# Altium schematic sheet FPGA_Banks_64_65_HR.SchDoc: =ProjectName
size 420 x 297 mm; Author: T.P.; CompanyName: WUT; DrawnBy: T.P.; Organization: WUT ISE; Address1: Warsaw Univeristy of Technology; Address2: Nowowiejska 25/29; DocumentNumber: 7; Revision: 0.9; SheetNumber: 7; SheetTotal: 36; EDA_Number: ARTIQ; Projet: ARTIQ/SINARA; ModifiedBy: -; CreateDate: XX/XX/XXXX; CheckedDate: -; Title2: FPGA_Banks_64_65_HR.SchDoc; DivGrp: ISE; Designer: G.K. and T.P.; ModifiedDate: -; ProjectName: ADC/DAC MEZZANINE
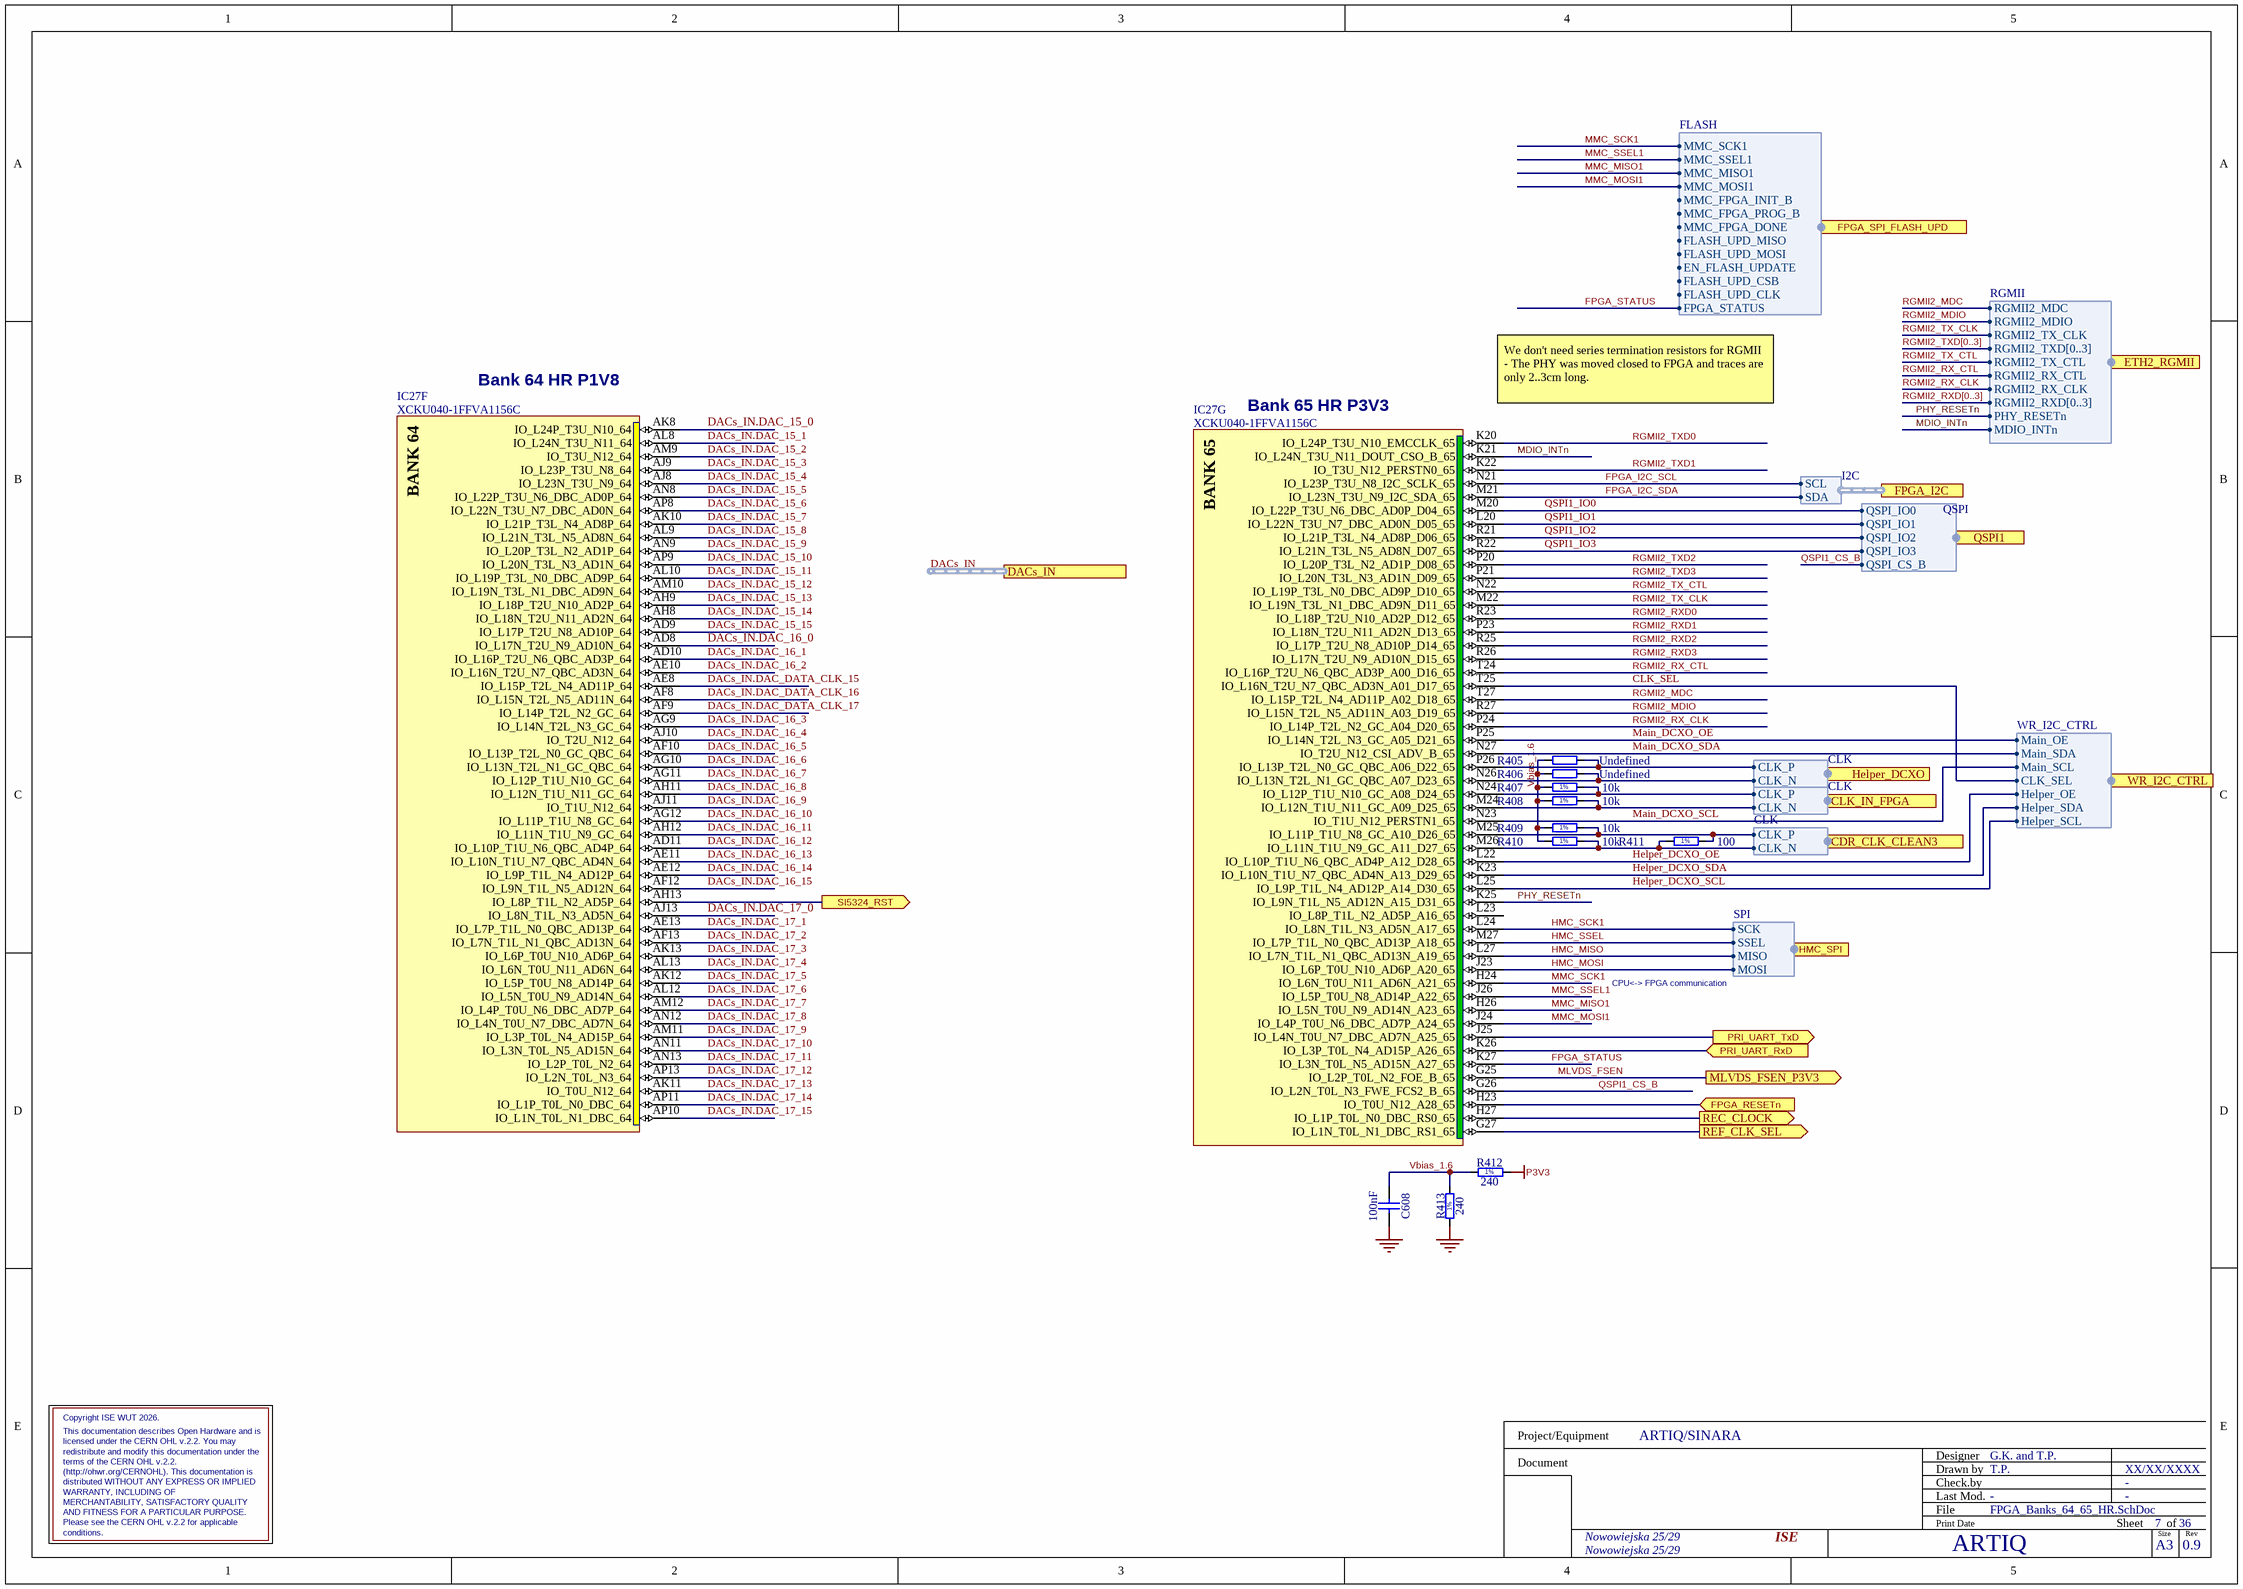
[diagram p0: FPGA_Banks_64_65_HR.SchDoc]

## Parts
C608  100nF  [CAPC0603X33N]
IC27  XCKU040-1FFVA1156C  [BGA1156C100P34X34_3500X3500X350]  (parts F,G of 22)
R405  Undefined  [RESC1005X40N]
R406  Undefined  [RESC1005X40N]
R407  10k  [RESC1005X40N]
R408  10k  [RESC1005X40N]
R409  10k  [RESC1005X40N]
R410  10k  [RESC1005X40N]
R411  100  [RESC1005X40N]
R412  240  [RESC1005X40N]
R413  240  [RESC1005X40N]

## Ports
CDR_CLK_CLEAN3 (harness CLK), CLK_IN_FPGA (harness CLK), DACs_IN (harness DAC_IN), ETH2_RGMII (harness RGMII), FPGA_I2C (harness I2C), FPGA_RESETn (in), FPGA_SPI_FLASH_UPD (harness FLASH), Helper_DCXO (harness CLK), HMC_SPI (harness SPI), MLVDS_FSEN_P3V3 (out), PRI_UART_RxD (in), PRI_UART_TxD (out), QSPI1 (harness QSPI), REC_CLOCK (out), REF_CLK_SEL (out), SI5324_RST (out), WR_I2C_CTRL (harness WR_I2C_CTRL)

## Harnesses
I2C: SCL, SDA
FLASH: MMC_SCK1, MMC_SSEL1, MMC_MISO1, MMC_MOSI1, MMC_FPGA_INIT_B, MMC_FPGA_PROG_B, MMC_FPGA_DONE, FLASH_UPD_MISO, FLASH_UPD_MOSI, EN_FLASH_UPDATE, FLASH_UPD_CSB, FLASH_UPD_CLK, FPGA_STATUS
CLK: CLK_N, CLK_P
QSPI: QSPI_IO1, QSPI_IO2, QSPI_IO3, QSPI_IO0, QSPI_CS_B
WR_I2C_CTRL: Main_OE, Main_SDA, Main_SCL, Helper_OE, Helper_SDA, Helper_SCL, CLK_SEL
SPI: SCK, SSEL, MISO, MOSI
RGMII: RGMII2_MDC, RGMII2_MDIO, RGMII2_TX_CLK, RGMII2_TXD[0..3], RGMII2_TX_CTL, RGMII2_RX_CTL, RGMII2_RX_CLK, RGMII2_RXD[0..3], PHY_RESETn, MDIO_INTn

## Nets
GND: C608.2 R413.1
P3V3: R412.2
CLK_SEL: IC27.T25(IO_L16N_T2U_N7_QBC_AD3N_A01_D17_65) ; port WR_I2C_CTRL.CLK_SEL
DACs_IN.DAC_15_0: IC27.AK8(IO_L24P_T3U_N10_64)
DACs_IN.DAC_15_1: IC27.AL8(IO_L24N_T3U_N11_64)
DACs_IN.DAC_15_2: IC27.AM9(IO_T3U_N12_64)
DACs_IN.DAC_15_3: IC27.AJ9(IO_L23P_T3U_N8_64)
DACs_IN.DAC_15_4: IC27.AJ8(IO_L23N_T3U_N9_64)
DACs_IN.DAC_15_5: IC27.AN8(IO_L22P_T3U_N6_DBC_AD0P_64)
DACs_IN.DAC_15_6: IC27.AP8(IO_L22N_T3U_N7_DBC_AD0N_64)
DACs_IN.DAC_15_7: IC27.AK10(IO_L21P_T3L_N4_AD8P_64)
DACs_IN.DAC_15_8: IC27.AL9(IO_L21N_T3L_N5_AD8N_64)
DACs_IN.DAC_15_9: IC27.AN9(IO_L20P_T3L_N2_AD1P_64)
DACs_IN.DAC_15_10: IC27.AP9(IO_L20N_T3L_N3_AD1N_64)
DACs_IN.DAC_15_11: IC27.AL10(IO_L19P_T3L_N0_DBC_AD9P_64)
DACs_IN.DAC_15_12: IC27.AM10(IO_L19N_T3L_N1_DBC_AD9N_64)
DACs_IN.DAC_15_13: IC27.AH9(IO_L18P_T2U_N10_AD2P_64)
DACs_IN.DAC_15_14: IC27.AH8(IO_L18N_T2U_N11_AD2N_64)
DACs_IN.DAC_15_15: IC27.AD9(IO_L17P_T2U_N8_AD10P_64)
DACs_IN.DAC_16_0: IC27.AD8(IO_L17N_T2U_N9_AD10N_64)
DACs_IN.DAC_16_1: IC27.AD10(IO_L16P_T2U_N6_QBC_AD3P_64)
DACs_IN.DAC_16_2: IC27.AE10(IO_L16N_T2U_N7_QBC_AD3N_64)
DACs_IN.DAC_16_3: IC27.AG9(IO_L14N_T2L_N3_GC_64)
DACs_IN.DAC_16_4: IC27.AJ10(IO_T2U_N12_64)
DACs_IN.DAC_16_5: IC27.AF10(IO_L13P_T2L_N0_GC_QBC_64)
DACs_IN.DAC_16_6: IC27.AG10(IO_L13N_T2L_N1_GC_QBC_64)
DACs_IN.DAC_16_7: IC27.AG11(IO_L12P_T1U_N10_GC_64)
DACs_IN.DAC_16_8: IC27.AH11(IO_L12N_T1U_N11_GC_64)
DACs_IN.DAC_16_9: IC27.AJ11(IO_T1U_N12_64)
DACs_IN.DAC_16_10: IC27.AG12(IO_L11P_T1U_N8_GC_64)
DACs_IN.DAC_16_11: IC27.AH12(IO_L11N_T1U_N9_GC_64)
DACs_IN.DAC_16_12: IC27.AD11(IO_L10P_T1U_N6_QBC_AD4P_64)
DACs_IN.DAC_16_13: IC27.AE11(IO_L10N_T1U_N7_QBC_AD4N_64)
DACs_IN.DAC_16_14: IC27.AE12(IO_L9P_T1L_N4_AD12P_64)
DACs_IN.DAC_16_15: IC27.AF12(IO_L9N_T1L_N5_AD12N_64)
DACs_IN.DAC_17_0: IC27.AJ13(IO_L8N_T1L_N3_AD5N_64)
DACs_IN.DAC_17_1: IC27.AE13(IO_L7P_T1L_N0_QBC_AD13P_64)
DACs_IN.DAC_17_2: IC27.AF13(IO_L7N_T1L_N1_QBC_AD13N_64)
DACs_IN.DAC_17_3: IC27.AK13(IO_L6P_T0U_N10_AD6P_64)
DACs_IN.DAC_17_4: IC27.AL13(IO_L6N_T0U_N11_AD6N_64)
DACs_IN.DAC_17_5: IC27.AK12(IO_L5P_T0U_N8_AD14P_64)
DACs_IN.DAC_17_6: IC27.AL12(IO_L5N_T0U_N9_AD14N_64)
DACs_IN.DAC_17_7: IC27.AM12(IO_L4P_T0U_N6_DBC_AD7P_64)
DACs_IN.DAC_17_8: IC27.AN12(IO_L4N_T0U_N7_DBC_AD7N_64)
DACs_IN.DAC_17_9: IC27.AM11(IO_L3P_T0L_N4_AD15P_64)
DACs_IN.DAC_17_10: IC27.AN11(IO_L3N_T0L_N5_AD15N_64)
DACs_IN.DAC_17_11: IC27.AN13(IO_L2P_T0L_N2_64)
DACs_IN.DAC_17_12: IC27.AP13(IO_L2N_T0L_N3_64)
DACs_IN.DAC_17_13: IC27.AK11(IO_T0U_N12_64)
DACs_IN.DAC_17_14: IC27.AP11(IO_L1P_T0L_N0_DBC_64)
DACs_IN.DAC_17_15: IC27.AP10(IO_L1N_T0L_N1_DBC_64)
DACs_IN.DAC_DATA_CLK_15: IC27.AE8(IO_L15P_T2L_N4_AD11P_64)
DACs_IN.DAC_DATA_CLK_16: IC27.AF8(IO_L15N_T2L_N5_AD11N_64)
DACs_IN.DAC_DATA_CLK_17: IC27.AF9(IO_L14P_T2L_N2_GC_64)
FPGA_I2C_SCL: IC27.N21(IO_L23P_T3U_N8_I2C_SCLK_65) ; port FPGA_I2C.SCL
FPGA_I2C_SDA: IC27.M21(IO_L23N_T3U_N9_I2C_SDA_65) ; port FPGA_I2C.SDA
FPGA_RESETn: IC27.H23(IO_T0U_N12_A28_65) ; port FPGA_RESETn
FPGA_STATUS: IC27.K27(IO_L3N_T0L_N5_AD15N_A27_65) ; port FPGA_SPI_FLASH_UPD.FPGA_STATUS
Helper_DCXO_OE: IC27.L22(IO_L10P_T1U_N6_QBC_AD4P_A12_D28_65) ; port WR_I2C_CTRL.Helper_OE
Helper_DCXO_SCL: IC27.L25(IO_L9P_T1L_N4_AD12P_A14_D30_65) ; port WR_I2C_CTRL.Helper_SCL
Helper_DCXO_SDA: IC27.K23(IO_L10N_T1U_N7_QBC_AD4N_A13_D29_65) ; port WR_I2C_CTRL.Helper_SDA
HMC_MISO: IC27.L27(IO_L7N_T1L_N1_QBC_AD13N_A19_65) ; port HMC_SPI.MISO
HMC_MOSI: IC27.J23(IO_L6P_T0U_N10_AD6P_A20_65) ; port HMC_SPI.MOSI
HMC_SCK1: IC27.L24(IO_L8N_T1L_N3_AD5N_A17_65) ; port HMC_SPI.SCK
HMC_SSEL: IC27.M27(IO_L7P_T1L_N0_QBC_AD13P_A18_65) ; port HMC_SPI.SSEL
Main_DCXO_OE: IC27.P25(IO_L14N_T2L_N3_GC_A05_D21_65) ; port WR_I2C_CTRL.Main_OE
Main_DCXO_SCL: IC27.N23(IO_T1U_N12_PERSTN1_65) ; port WR_I2C_CTRL.Main_SCL
Main_DCXO_SDA: IC27.N27(IO_T2U_N12_CSI_ADV_B_65) ; port WR_I2C_CTRL.Main_SDA
MDIO_INTn: IC27.K21(IO_L24N_T3U_N11_DOUT_CSO_B_65) ; port ETH2_RGMII.MDIO_INTn
MLVDS_FSEN: IC27.G25(IO_L2P_T0L_N2_FOE_B_65) ; port MLVDS_FSEN_P3V3
MMC_MISO1: IC27.H26(IO_L5N_T0U_N9_AD14N_A23_65) ; port FPGA_SPI_FLASH_UPD.MMC_MISO1
MMC_MOSI1: IC27.J24(IO_L4P_T0U_N6_DBC_AD7P_A24_65) ; port FPGA_SPI_FLASH_UPD.MMC_MOSI1
MMC_SCK1: IC27.H24(IO_L6N_T0U_N11_AD6N_A21_65) ; port FPGA_SPI_FLASH_UPD.MMC_SCK1
MMC_SSEL1: IC27.J26(IO_L5P_T0U_N8_AD14P_A22_65) ; port FPGA_SPI_FLASH_UPD.MMC_SSEL1
PHY_RESETn: IC27.K25(IO_L9N_T1L_N5_AD12N_A15_D31_65) ; port ETH2_RGMII.PHY_RESETn
PRI_UART_RxD: IC27.K26(IO_L3P_T0L_N4_AD15P_A26_65) ; port PRI_UART_RxD
PRI_UART_TxD: IC27.J25(IO_L4N_T0U_N7_DBC_AD7N_A25_65) ; port PRI_UART_TxD
QSPI1_CS_B: IC27.G26(IO_L2N_T0L_N3_FWE_FCS2_B_65) ; port QSPI1.QSPI_CS_B
QSPI1_IO0: IC27.M20(IO_L22P_T3U_N6_DBC_AD0P_D04_65) ; port QSPI1.QSPI_IO0
QSPI1_IO1: IC27.L20(IO_L22N_T3U_N7_DBC_AD0N_D05_65) ; port QSPI1.QSPI_IO1
QSPI1_IO2: IC27.R21(IO_L21P_T3L_N4_AD8P_D06_65) ; port QSPI1.QSPI_IO2
QSPI1_IO3: IC27.R22(IO_L21N_T3L_N5_AD8N_D07_65) ; port QSPI1.QSPI_IO3
REC_CLOCK: IC27.H27(IO_L1P_T0L_N0_DBC_RS0_65) ; port REC_CLOCK
REF_CLK_SEL: IC27.G27(IO_L1N_T0L_N1_DBC_RS1_65) ; port REF_CLK_SEL
RGMII2_MDC: IC27.T27(IO_L15P_T2L_N4_AD11P_A02_D18_65) ; port ETH2_RGMII.RGMII2_MDC
RGMII2_MDIO: IC27.R27(IO_L15N_T2L_N5_AD11N_A03_D19_65) ; port ETH2_RGMII.RGMII2_MDIO
RGMII2_RX_CLK: IC27.P24(IO_L14P_T2L_N2_GC_A04_D20_65) ; port ETH2_RGMII.RGMII2_RX_CLK
RGMII2_RX_CTL: IC27.T24(IO_L16P_T2U_N6_QBC_AD3P_A00_D16_65) ; port ETH2_RGMII.RGMII2_RX_CTL
RGMII2_RXD0: IC27.R23(IO_L18P_T2U_N10_AD2P_D12_65)
RGMII2_RXD1: IC27.P23(IO_L18N_T2U_N11_AD2N_D13_65)
RGMII2_RXD2: IC27.R25(IO_L17P_T2U_N8_AD10P_D14_65)
RGMII2_RXD3: IC27.R26(IO_L17N_T2U_N9_AD10N_D15_65)
RGMII2_TX_CLK: IC27.M22(IO_L19N_T3L_N1_DBC_AD9N_D11_65) ; port ETH2_RGMII.RGMII2_TX_CLK
RGMII2_TX_CTL: IC27.N22(IO_L19P_T3L_N0_DBC_AD9P_D10_65) ; port ETH2_RGMII.RGMII2_TX_CTL
RGMII2_TXD0: IC27.K20(IO_L24P_T3U_N10_EMCCLK_65)
RGMII2_TXD1: IC27.K22(IO_T3U_N12_PERSTN0_65)
RGMII2_TXD2: IC27.P20(IO_L20P_T3L_N2_AD1P_D08_65)
RGMII2_TXD3: IC27.P21(IO_L20N_T3L_N3_AD1N_D09_65)
SI5324_RST: IC27.AH13(IO_L8P_T1L_N2_AD5P_64) ; port SI5324_RST
Vbias_1.6: C608.1 R405.1 R406.1 R407.1 R408.1 R409.1 R410.1 R412.1 R413.2
NetIC27_M24: IC27.M24(IO_L12N_T1U_N11_GC_A09_D25_65) R408.2 ; port CLK_IN_FPGA.CLK_N
NetIC27_M25: IC27.M25(IO_L11P_T1U_N8_GC_A10_D26_65) R409.2 R411.2 ; port CDR_CLK_CLEAN3.CLK_P
NetIC27_M26: IC27.M26(IO_L11N_T1U_N9_GC_A11_D27_65) R410.2 R411.1 ; port CDR_CLK_CLEAN3.CLK_N
NetIC27_N24: IC27.N24(IO_L12P_T1U_N10_GC_A08_D24_65) R407.2 ; port CLK_IN_FPGA.CLK_P
NetIC27_N26: IC27.N26(IO_L13N_T2L_N1_GC_QBC_A07_D23_65) R406.2 ; port Helper_DCXO.CLK_N
NetIC27_P26: IC27.P26(IO_L13P_T2L_N0_GC_QBC_A06_D22_65) R405.2 ; port Helper_DCXO.CLK_P

Not connected (* = marked no-connect by the designer): IC27 L23(IO_L8P_T1L_N2_AD5P_A16_65)

## Buses and harness runs
bus RGMII2_RXD[0..3]
bus RGMII2_TXD[0..3]
harness DACs_IN = port DACs_IN

## Notes on the sheet
- Bank 64 HR P1V8
- (near IC27) We don't need series termination resistors for RGMII - The PHY was moved closed to FPGA and traces are only 2..3cm long.
- Bank 65 HR P3V3
- CPU<-> FPGA communication
- Copyright ISE WUT 2026.
- This documentation describes Open Hardware and is
- (http://ohwr.org/CERNOHL). This documentation is
- redistribute and modify this documentation under the
- terms of the CERN OHL v.2.2.
- distributed WITHOUT ANY EXPRESS OR IMPLIED
- licensed under the CERN OHL v.2.2. You may
- AND FITNESS FOR A PARTICULAR PURPOSE.
- Please see the CERN OHL v.2.2 for applicable
- conditions.
- WARRANTY, INCLUDING OF
- MERCHANTABILITY, SATISFACTORY QUALITY
- Project/Equipment
- Document
- Designer
- Drawn by
- Check.by
- File
- Last Mod.
- Print Date
- Sheet
- Size
- A3
- of
- Rev
- (in symbol R0402_10K_1%_0.0625W_100PPM) 1%
- (in symbol R0402_100R_1%_0.0625W_100PPM) 1%
- (in symbol R0402_240R_1%_0.0625W_100PPM) 1%
- (in symbol XCKU040-1FFVA1156C, part F) BANK 64
- (in symbol XCKU040-1FFVA1156C, part G) BANK 65

## Library data of the parts
C608 = CC0201_100NF_6.3V_10%_X5R: Non-polarised capacitor; Part Description: SMD Multilayer Chip Ceramic Capacitor; Manufacturer: GENERIC; Manufacturer1 Part Number: 02016D104KAT2A; Voltage: 6.3V; TC: X5R; Tolerance: ±10%; Part Number: CC0201_100NF_6.3V_10%_X5R; Component Kind: Standard; Component Type: Standard; Pin Count: 2; Value: 100nF; Status: Not Recommended; Manufacturer Part Number: CC0201_100NF_6.3V_10%_X5R; Case: 0201; Mounted: Yes; Socket: No; SMD: Yes; Sense: No; Manufacturer1 Example: AVX; Manufacturer1 ComponentHeight: 0.33mm; HelpURL: \\cern.ch\dfs\Applications\Altium\Datasheets\CC0201_X5R_AVX.pdf; Author: CERN DEM JLC; CreateDate: 03.12.2007; LatestRevisionDate: 03.12.2007
IC27 = XCKU040-1FFVA1156C: Kintex UltraScale FPGA, 520 I/O, 530K Cells, 1156-Ball BGA, Speed Grade 1, Commercial Grade; Part Description: Kintex UltraScale, 40 DLL I/O, 416 HP I/O, 104 HR I/O, 1156-Pin BGA, Speed Grade 1, Commercial Grade; Manufacturer: XILINX; PressFit: No; Bonding: No; Part Number: XCKU040-1FFVA1156C; Component Kind: Standard; Component Type: Standard; Device: XCKU040-1FFVA1156C; PackageDescription: BGA, 1.00mm Pitch, Square; 1156 Pin, 34 Columns X 34 Rows, Body 35.00mm X 35.00mm X 3.50mm H, IPC Medium Density; Manufacturer Part Number: XCKU040-1FFVA1156C; Pin Count: 1156; Case: BGA1156; Mounted: Yes; Socket: No; SMD: Yes; Sense: No; ComponentHeight: 3.5mm; HelpURL: \\cern.ch\dfs\Applications\Altium\Datasheets\XCKU040-1FFVA1156C.pdf; ComponentLink1URL: \\cern.ch\dfs\Applications\Altium\Datasheets\XCKU040-1FFVA1156C_Package-Pinout.pdf; ComponentLink1Description: Package/Pinout; Author: CERN DEM CA; CreateDate: 16.08.2016; LatestRevisionDate: 16.08.2016
R405 R406 = R0402_NO-VALUE: Resistor; Part Description: Reserved Footprint For a 0402 (1005) Chip Resistor; PressFit: No; Mounted: No; Part Number: R0402_NO-VALUE; Component Kind: Standard; Component Type: Standard; Pin Count: 2; Value: Undefined; Status: None; Manufacturer: Undefined; Manufacturer Part Number: R0402_NO-VALUE; Case: 0402; Sense: No; Socket: No; SMD: Yes; Manufacturer1 Example: Undefined; Manufacturer1 Part Number: Undefined; Manufacturer1 ComponentHeight: Undefined; HelpURL: Undefined; Author: CERN DEM JLC; CreateDate: 03.12.2007; LatestRevisionDate: 13.03.2008
R407-R410 = R0402_10K_1%_0.0625W_100PPM: Resistor - 1%; Part Description: General Purpose Thick Film Chip Resistor; Manufacturer: GENERIC; Manufacturer1 Part Number: 232270671003L; TC: ±100ppm/°C; PressFit: No; Part Number: R0402_10K_1%_0.0625W_100PPM; Component Kind: Standard; Component Type: Standard; Pin Count: 2; Value: 10k; Status: Not Recommended; Power: 0.0625W; Tolerance: ±1%; Manufacturer Part Number: R0402_10K_1%_0.0625W_100PPM; Case: 0402; Mounted: Yes; Sense: No; Socket: No; SMD: Yes; Manufacturer1 Example: YAGEO PHYCOMP; Manufacturer1 ComponentHeight: 0.4mm; HelpURL: \\cern.ch\dfs\Applications\Altium\Datasheets\R0402_Phycomp_RC0402.pdf; Author: CERN DEM JLC; CreateDate: 03.12.2007; LatestRevisionDate: 17.10.2012
R411 = R0402_100R_1%_0.0625W_100PPM: Resistor - 1%; Part Description: General Purpose Thick Film Chip Resistor; Manufacturer: GENERIC; Manufacturer1 Part Number: 232270671001L; TC: ±100ppm/°C; PressFit: No; Part Number: R0402_100R_1%_0.0625W_100PPM; Component Kind: Standard; Component Type: Standard; Pin Count: 2; Value: 100; Status: Not Recommended; Power: 0.0625W; Tolerance: ±1%; Manufacturer Part Number: R0402_100R_1%_0.0625W_100PPM; Case: 0402; Mounted: Yes; Sense: No; Socket: No; SMD: Yes; Manufacturer1 Example: YAGEO PHYCOMP; Manufacturer1 ComponentHeight: 0.4mm; HelpURL: \\cern.ch\dfs\Applications\Altium\Datasheets\R0402_Phycomp_RC0402.pdf; Author: CERN DEM JLC; CreateDate: 03.12.2007; LatestRevisionDate: 17.10.2012
R412 R413 = R0402_240R_1%_0.0625W_100PPM: Resistor - 1%; Part Description: General Purpose Thick Film Chip Resistor; Manufacturer: GENERIC; Manufacturer1 Part Number: 232270672401L; TC: ±100ppm/°C; PressFit: No; Part Number: R0402_240R_1%_0.0625W_100PPM; Component Kind: Standard; Component Type: Standard; Pin Count: 2; Value: 240; Status: Not Recommended; Power: 0.0625W; Tolerance: ±1%; Manufacturer Part Number: R0402_240R_1%_0.0625W_100PPM; Case: 0402; Mounted: Yes; Sense: No; Socket: No; SMD: Yes; Manufacturer1 Example: YAGEO PHYCOMP; Manufacturer1 ComponentHeight: 0.4mm; HelpURL: \\cern.ch\dfs\Applications\Altium\Datasheets\R0402_Phycomp_RC0402.pdf; Author: CERN DEM JLC; CreateDate: 03.12.2007; LatestRevisionDate: 17.10.2012